# Altium schematic sheet v1.0.SchDoc
size 50 x 33 mm
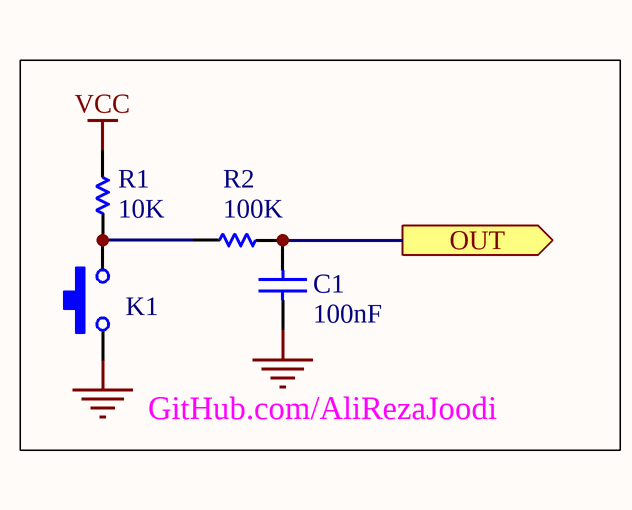
[diagram p0: v1.0.SchDoc]

## Parts
C1  100nF  [CAPNTO2.54-3.56x2.03]
K1  Switch_SW-PB  [SWPBT_SPST_6X6X4]  (value not drawn)
R1  10K  [R_THD_AXIAL0.4(1/4W)]
R2  100K  [R_THD_AXIAL0.4(1/4W)]

## Ports
OUT (out)

## Nets
GND: C1.2 K1.1
VCC: R1.2
OUT: C1.1 R2.1 ; port OUT
NetK1_2: K1.2 R1.1 R2.2

## Notes on the sheet
- GitHub.com/AliRezaJoodi

## Library data of the parts
C1 = Cap: Capacitor; Manufacturer: Generic Components; Class I: Passive; Published: 8-Jun-2000; Revision: July-2002: Re-released for DXP Platform.; Publisher: Altium Limited; Class II: Capacitor
K1 = Switch_SW-PB_2Form: Switch, SW-PB; Manufacturer: Generic Components; Published: 24-Mar-1999; Revision: July-2002: Re-released for DXP Platform.; Publisher: Altium Limited
R1 R2 = Resistor: Revision: July-2002: Re-released for DXP Platform.